# Altium schematic sheet load-cal-board-1point2in.SchDoc
size A; SheetNumber: 1; SheetTotal: 1
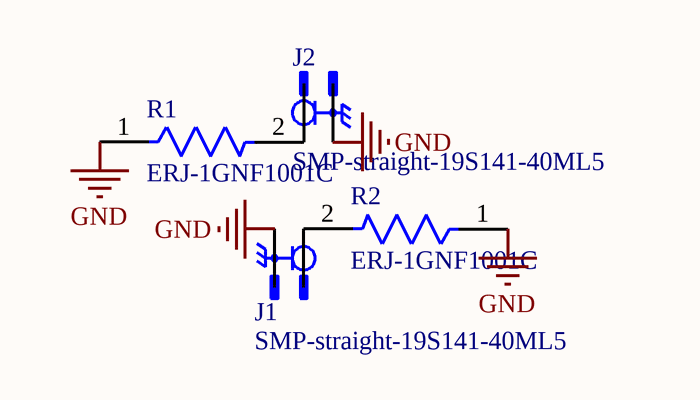
[diagram p0: load-cal-board-1point2in.SchDoc]

## Parts
J1  SMP-straight-19S141-40ML5  [rosenberger-19S141-40ML5]
J2  SMP-straight-19S141-40ML5  [rosenberger-19S141-40ML5]
R1  ERJ-1GNF1001C  [FP-ERJ1GN-IPC_C]
R2  ERJ-1GNF1001C  [FP-ERJ1GN-IPC_C]

## Nets
GND: J1.gnd J2.gnd R1.1 R2.1
NetJ1_1: J1.1 R2.2
NetJ2_1: J2.1 R1.2

## Library data of the parts
J1 J2 = SMP-straight-19S141-40ML5: SMP Connector Plug, Male Pin 50Ohm Surface Mount Solder; MP: 853050232; MF: Molex; Check_prices: https://www.snapeda.com/parts/853050232/Molex/view-part/?ref=eda; Value: *; Availability: In Stock; Price: None; Package: None; SnapEDA_Link: https://www.snapeda.com/parts/853050232/Molex/view-part/?ref=snap; Purchase-URL: https://pricing.snapeda.com/search/part/853050232/?ref=eda; Supplier 1: Mouser; Supplier Part Number 1: 476-19S201-40ML5
R1 R2 = CMP-1010-00416-3: RES SMD 1K OHM 1% 1/20W 0201; Temperature Coefficient: 200ppm/°C; Max Power Dissipation: 50mW; Voltage Rating (DC): 25V; Resistance: 1kR; Number of Pins: 2; Height: 0.01inch; Weight: 6E-06oz; Min Operating Temperature: -55°C; Features: Automotive AEC-Q200; Radiation Hardening: No; Resistor Type: Thick Film; RoHS Compliant: Yes; Termination: SMD/SMT; Package Quantity: 15000; Size Code: 0201; Case Code (Imperial): 0201; Resistance Tolerance: 1%; Contact Plating: Tin; Case/Package: 0201; Lead Free: Lead Free; Number of Terminations: 2; Tolerance: 1%; Max Operating Temperature: 125°C; Mount: Surface Mount; Width: 0.012inch; Series: ERJ; Voltage Rating: 25V; Power Rating: 50mW; Packaging: Tape and Reel; Length: 0.6mm; Case Code (Metric): 0603